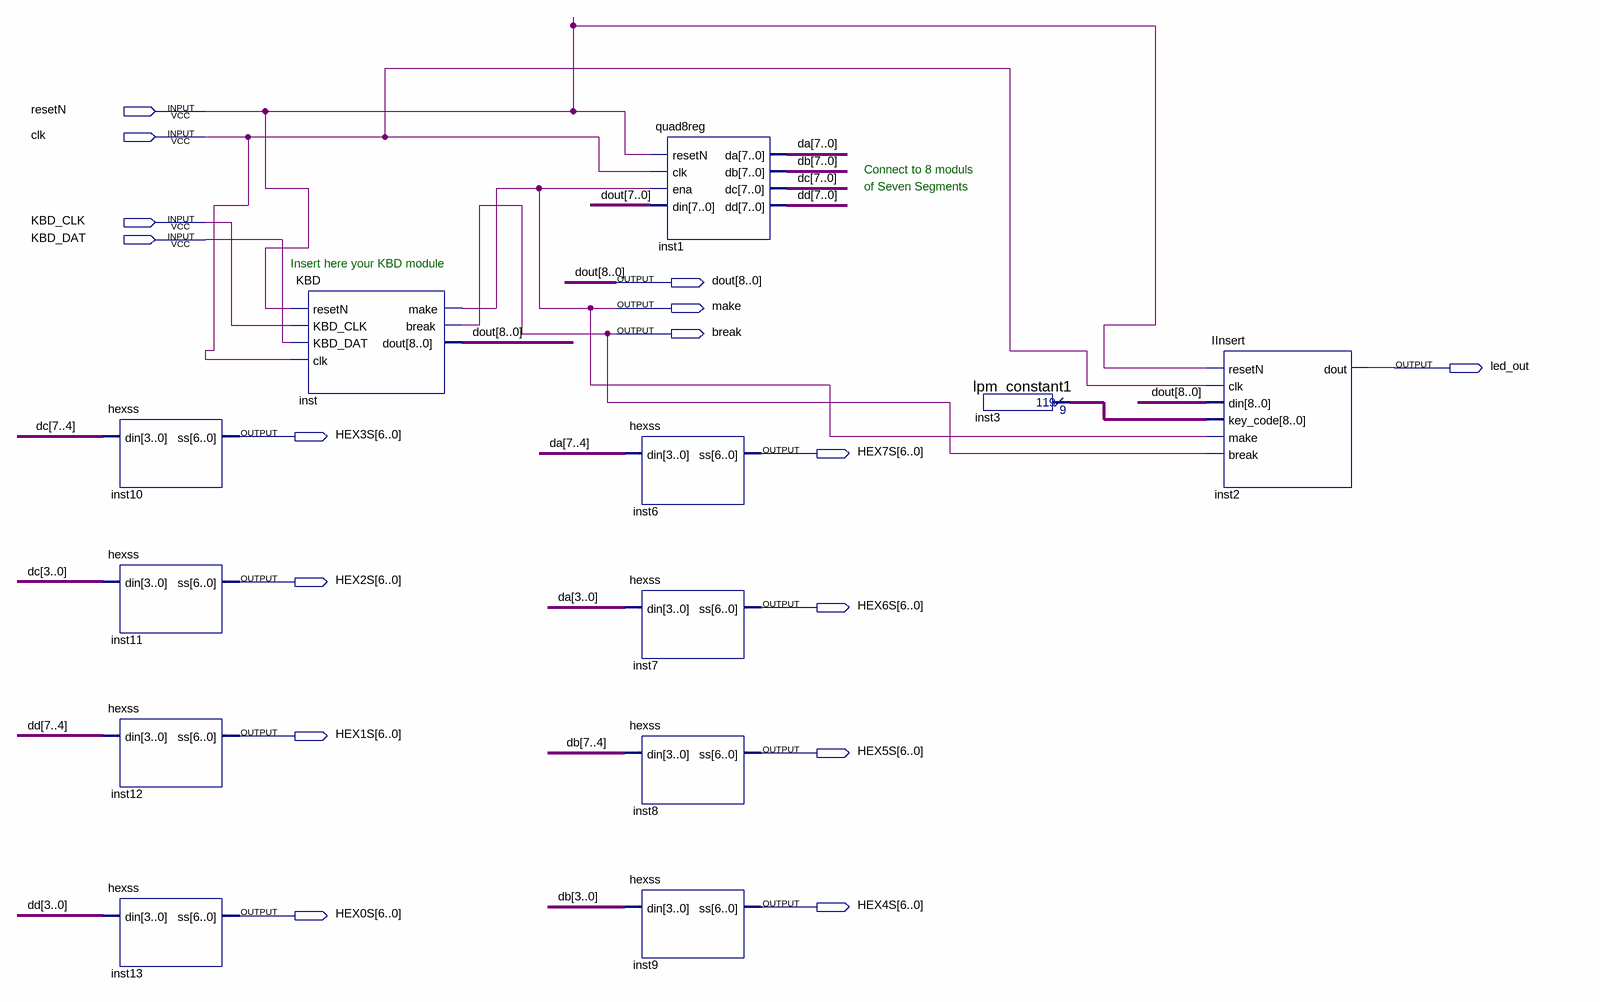
[diagram p0: schematic sheet]
// Quartus schematic TEST_NumLock_fixed.bdf as structural Verilog: 12 symbols, 16 pins
module TEST_NumLock_fixed (
  input  resetN,
  input  clk,
  input  KBD_CLK,
  input  KBD_DAT,
  output [8:0] dout,
  output make,
  output \break ,
  output led_out,
  output [6:0] HEX3S,
  output [6:0] HEX7S,
  output [6:0] HEX2S,
  output [6:0] HEX6S,
  output [6:0] HEX1S,
  output [6:0] HEX5S,
  output [6:0] HEX4S,
  output [6:0] HEX0S
);

  wire [7:0] da, db, dc, dd;
  wire [8:0] inst3_result;

  hexss inst10 (.din(dc[7:4]), .ss(HEX3S));
  hexss inst11 (.din(dc[3:0]), .ss(HEX2S));
  hexss inst12 (.din(dd[7:4]), .ss(HEX1S));
  hexss inst13 (.din(dd[3:0]), .ss(HEX0S));
  KBD inst (
    .resetN(resetN), .KBD_CLK(KBD_CLK), .KBD_DAT(KBD_DAT), .clk(clk), .make(make), .\break (\break ),
    .dout(dout));
  quad8reg inst1 (.resetN(resetN), .clk(clk), .ena(make), .din(dout[7:0]), .da(da), .db(db), .dc(dc), .dd(dd));
  hexss inst6 (.din(da[7:4]), .ss(HEX7S));
  hexss inst7 (.din(da[3:0]), .ss(HEX6S));
  hexss inst8 (.din(db[7:4]), .ss(HEX5S));
  hexss inst9 (.din(db[3:0]), .ss(HEX4S));
  lpm_constant1 inst3 (.result(inst3_result));
  IInsert inst2 (
    .resetN(resetN), .clk(clk), .din(dout), .key_code(inst3_result), .make(make), .\break (\break ),
    .dout(led_out));

  // Notes on the sheet:
  //   Connect to 8 moduls
  //   of Seven Segments
  //   Insert here your KBD module
endmodule
